# EAGLE schematic 20V-3V3-Divider (EAGLE 9.5.2)
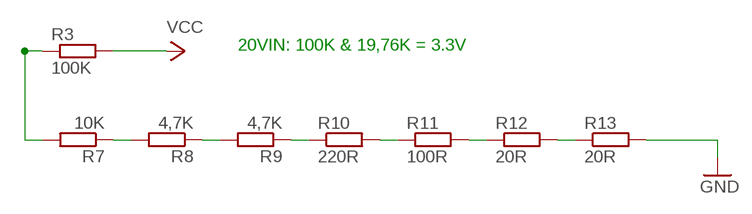
[diagram p0: schematic, sheet 1]

## Parts
R3  100K  R-EU_0204/7  [0204/7]
R7  10K  R-EU_0204/7  [0204/7]
R8  4,7K  R-EU_0204/7  [0204/7]
R9  4,7K  R-EU_0204/7  [0204/7]
R10  220R  R-EU_0204/7  [0204/7]
R11  100R  R-EU_0204/7  [0204/7]
R12  20R  R-EU_0204/7  [0204/7]
R13  20R  R-EU_0204/7  [0204/7]

## Nets
GND [Chassis]: R13.2
N$1: R3.1 R7.2
N$2: R7.1 R8.2
N$3: R8.1 R9.2
N$4: R9.1 R10.1
N$5: R10.2 R11.1
N$6: R11.2 R12.1
N$7: R12.2 R13.1
VCC [11..14v Generator]: R3.2

## Notes on the sheet
- 20VIN: 100K & 19,76K = 3.3V

## Library data of the parts
R3 R7-R13 = rcl:R-EU_: RESISTOR, European symbol; SPICEPREFIX: R

## Net classes
0 default: width 0.025 mm, clearance 0.076 mm
4 11..14v Generator: width 1.27 mm, clearance 1.27 mm
5 Chassis: width 0.762 mm, clearance 0.076 mm